# Altium project Relay PCB.PrjPcb
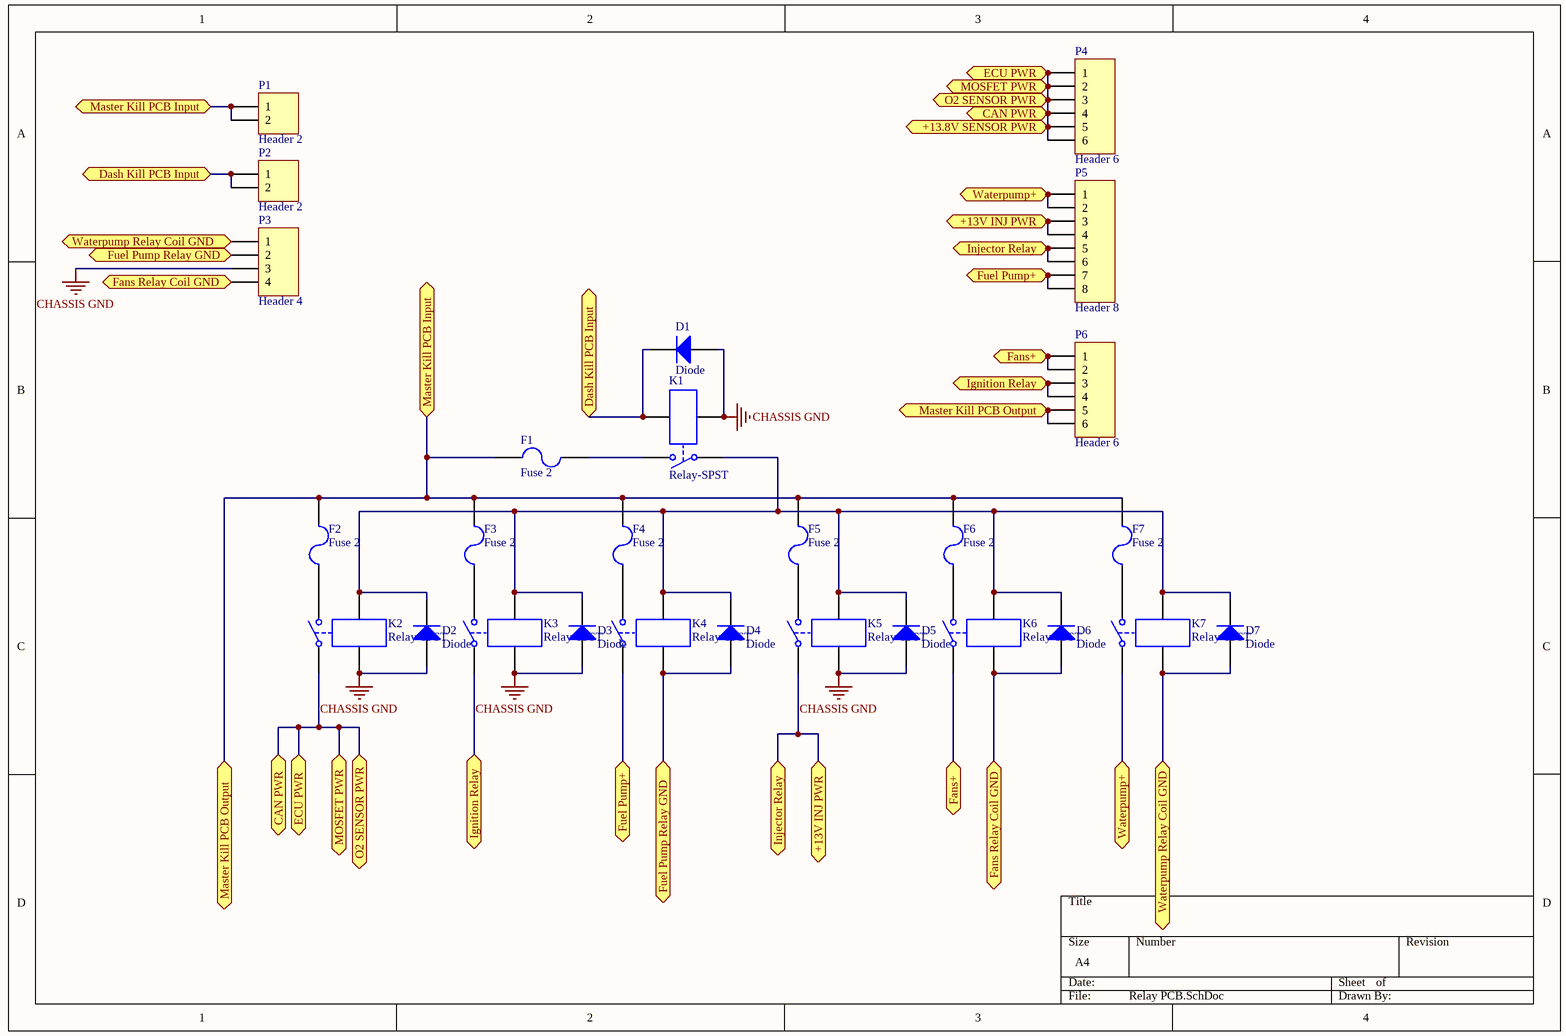
[diagram p0: Relay PCB.SchDoc]
2 sheets, 37 parts. Net scope: flat (ports and power ports of the same name join across sheets).
Board file: Relay PCB.PcbDoc
Sheets:
  Relay PCB.SchDoc
  EnclosurePinout.SchDoc

## Sheet Relay PCB.SchDoc
size A4

### Parts
D1  Diode  [SMC]
D2  Diode  [SMC]
D3  Diode  [SMC]
D4  Diode  [SMC]
D5  Diode  [SMC]
D6  Diode  [SMC]
D7  Diode  [SMC]
F1  Fuse 2  [PIN-W2/E2.8]
F2  Fuse 2  [PIN-W2/E2.8]
F3  Fuse 2  [PIN-W2/E2.8]
F4  Fuse 2  [PIN-W2/E2.8]
F5  Fuse 2  [PIN-W2/E2.8]
F6  Fuse 2  [PIN-W2/E2.8]
F7  Fuse 2  [PIN-W2/E2.8]
K1  Relay-SPST  [MODULE4]
K2  Relay-SPST  [MODULE4]
K3  Relay-SPST  [MODULE4]
K4  Relay-SPST  [MODULE4]
K5  Relay-SPST  [MODULE4]
K6  Relay-SPST  [MODULE4]
K7  Relay-SPST  [MODULE4]
P1  Header 2  [HDR1X2]
P2  Header 2  [HDR1X2]
P3  Header 4  [HDR1X4]
P4  Header 6  [HDR1X6]
P5  Header 8  [HDR1X8]
P6  Header 6  [HDR1X6]

### Ports
+13.8V SENSOR PWR, +13V INJ PWR, CAN PWR, Dash Kill PCB Input, ECU PWR, Fans Relay Coil GND, Fans+, Fuel Pump Relay GND, Fuel Pump+, Ignition Relay, Injector Relay, Master Kill PCB Input, Master Kill PCB Output, MOSFET PWR, O2 SENSOR PWR, Waterpump Relay Coil GND, Waterpump+

### Nets
CHASSIS GND: D1.1(A) D2.1(A) D3.1(A) D5.1(A) K1.3 K2.3 K3.3 K5.3 P3.3
NetActuator_1: K3.1 P6.3 P6.4 ; port Ignition Relay
NetActuator_2: K5.1 P5.3 P5.4 P5.5 P5.6 ; port Injector Relay, port +13V INJ PWR
NetCAN_1: K2.1 P4.1 P4.2 P4.3 P4.4 P4.5 P4.6 ; port ECU PWR, port MOSFET PWR, port O2 SENSOR PWR, port CAN PWR, port +13.8V SENSOR PWR
NetD1_2: D1.2(K) K1.4 P2.1 P2.2 ; port Dash Kill PCB Input
NetD2_2: D2.2(K) D3.2(K) D4.2(K) D5.2(K) D6.2(K) D7.2(K) K1.1 K2.4 K3.4 K4.4 K5.4 K6.4 K7.4
NetD4_1: D4.1(A) K4.3 P3.2 ; port Fuel Pump Relay GND
NetD6_1: D6.1(A) K6.3 P3.4 ; port Fans Relay Coil GND
NetD7_1: D7.1(A) K7.3 P3.1 ; port Waterpump Relay Coil GND
NetDash_1: F1.1 F2.2 F3.2 F4.2 F5.2 F6.2 F7.2 P1.1 P1.2 P6.5 P6.6 ; port Master Kill PCB Input, port Master Kill PCB Output
NetF1_2: F1.2 K1.2
NetF2_1: F2.1 K2.2
NetF3_1: F3.1 K3.2
NetF4_1: F4.1 K4.2
NetF5_1: F5.1 K5.2
NetF6_1: F6.1 K6.2
NetF7_1: F7.1 K7.2
NetK4_1: K4.1 P5.7 P5.8 ; port Fuel Pump+
NetK6_1: K6.1 P6.1 P6.2 ; port Fans+
NetK7_1: K7.1 P5.1 P5.2 ; port Waterpump+

### Library data of the parts
D1-D7 = Diode: Default Diode; Published: 8-Jun-2000; LatestRevisionDate: 17-Jul-2002; LatestRevisionNote: Re-released for DXP Platform.; PackageVersion: Sep-1996; PackageReference: SMC; Publisher: Altium Limited; PackageDescription: DO-214-AB/SMC; 2 C-Bend Leads; Body 7.9 x 5.9 mm, inc. leads (LxW); Code_JEDEC: DO-214-AB
F1-F7 = Fuse 2: Fuse; Published: 8-Jun-2000; LatestRevisionDate: 17-Jul-2002; LatestRevisionNote: Re-released for DXP Platform.; PackageReference: PIN-W2/E2.8; Publisher: Altium Limited; PackageDescription: Thru-Hole; 2 Leads
K1-K7 = Relay-SPST: Single-Pole Single-Throw Relay; Published: 24-Mar-1999; LatestRevisionDate: 17-Jul-2002; LatestRevisionNote: Re-released for DXP Platform.; PackageReference: MODULE4; Publisher: Altium Limited
P1 P2 = Header 2: Header, 2-Pin; LatestRevisionDate: 17-Jul-2002; LatestRevisionNote: Re-released for DXP Platform.; Publisher: Altium Limited
P3 = Header 4: Header, 4-Pin; LatestRevisionDate: 17-Jul-2002; LatestRevisionNote: Re-released for DXP Platform.; Publisher: Altium Limited
P4 P6 = Header 6: Header, 6-Pin; LatestRevisionDate: 17-Jul-2002; LatestRevisionNote: Re-released for DXP Platform.; Publisher: Altium Limited
P5 = Header 8: Header, 8-Pin; LatestRevisionDate: 17-Jul-2002; LatestRevisionNote: Re-released for DXP Platform.; Publisher: Altium Limited

## Sheet EnclosurePinout.SchDoc
size A3
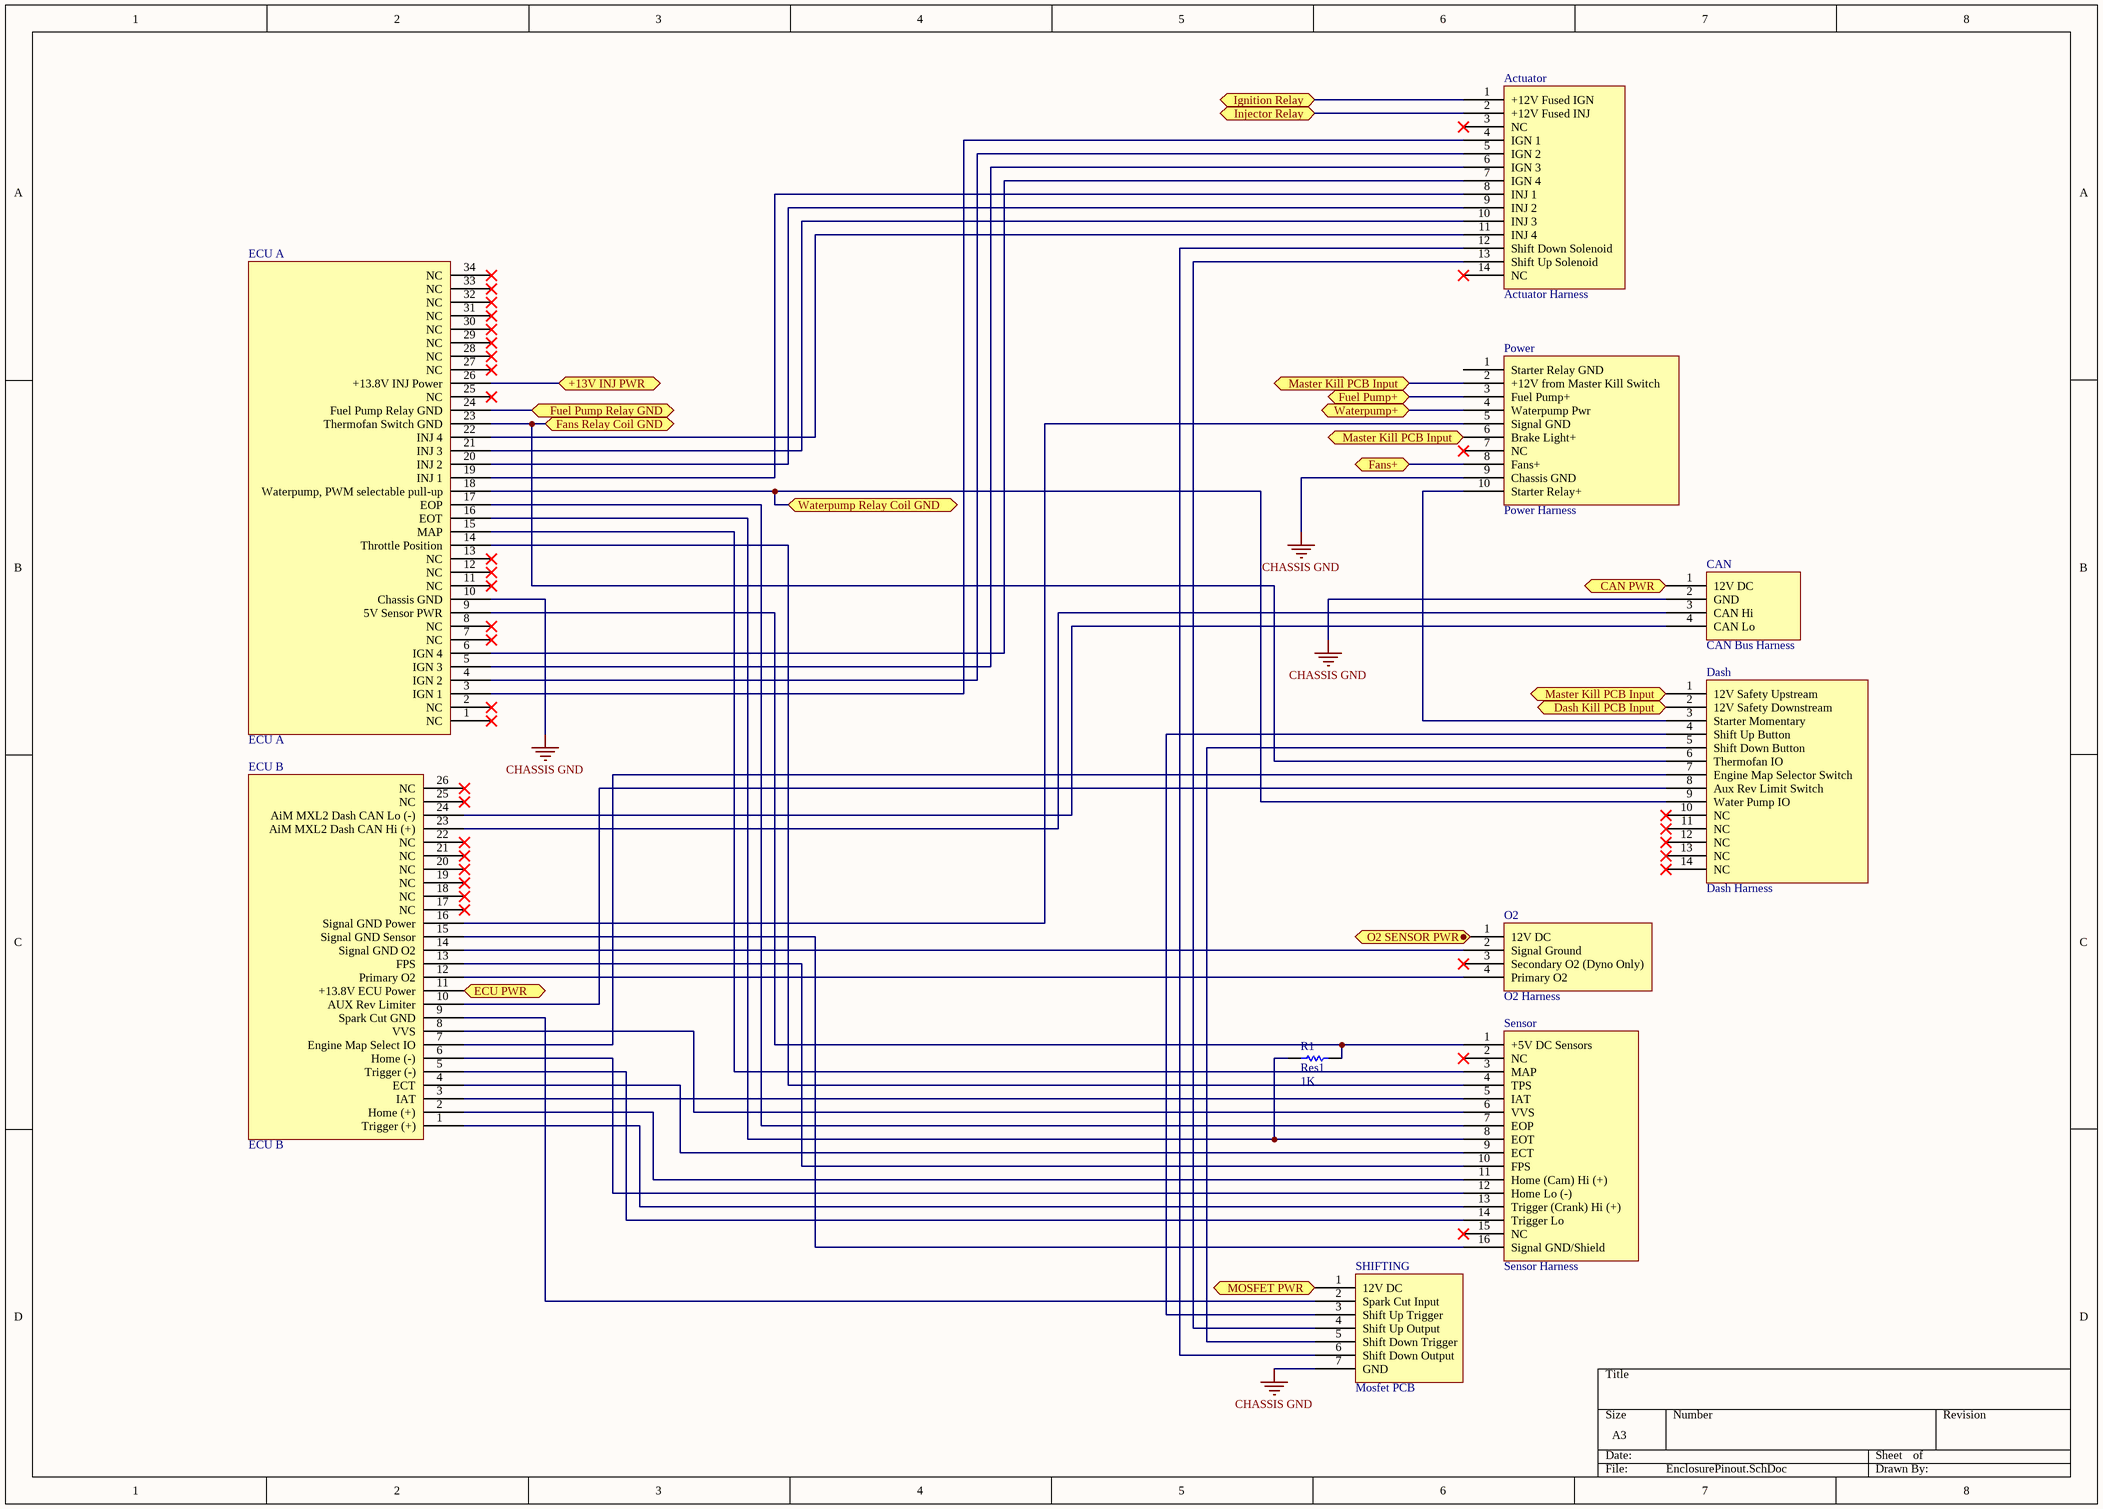
[diagram p1: EnclosurePinout.SchDoc]

### Parts
Actuator  Actuator Harness
CAN  CAN Bus Harness
Dash  Dash Harness
ECU_A  ECU A
ECU_B  ECU B
O2  O2 Harness
Power  Power Harness
R1  Res1  value 1K  [AXIAL-0.3]
Sensor  Sensor Harness
SHIFTING  Mosfet PCB

### Ports
+13V INJ PWR, CAN PWR, Dash Kill PCB Input, ECU PWR, Fans Relay Coil GND, Fans+, Fuel Pump Relay GND, Fuel Pump+, Ignition Relay, Injector Relay, Master Kill PCB Input, MOSFET PWR, O2 SENSOR PWR, Waterpump Relay Coil GND, Waterpump+

### Nets
CHASSIS GND: CAN.2(GND) ECU_A.10(Chassis_GND) Power.9(Chassis_GND) SHIFTING.7(GND)
NetActuator_1: Actuator.1(+12V_Fused_IGN) ; port Ignition Relay
NetActuator_2: Actuator.2(+12V_Fused_INJ) ECU_A.26(+13.8V_INJ_Power) ; port +13V INJ PWR, port Injector Relay
NetActuator_4: Actuator.4(IGN_1) ECU_A.3(IGN_1)
NetActuator_5: Actuator.5(IGN_2) ECU_A.4(IGN_2)
NetActuator_6: Actuator.6(IGN_3) ECU_A.5(IGN_3)
NetActuator_7: Actuator.7(IGN_4) ECU_A.6(IGN_4)
NetActuator_8: Actuator.8(INJ_1) ECU_A.19(INJ_1)
NetActuator_9: Actuator.9(INJ_2) ECU_A.20(INJ_2)
NetActuator_10: Actuator.10(INJ_3) ECU_A.21(INJ_3)
NetActuator_11: Actuator.11(INJ_4) ECU_A.22(INJ_4)
NetActuator_12: Actuator.12(Shift_Down_Solenoid) SHIFTING.6(Shift_Down_Output)
NetActuator_13: Actuator.13(Shift_Up_Solenoid) SHIFTING.4(Shift_Up_Output)
NetCAN_1: CAN.1(12V_DC) ECU_B.11(+13.8V_ECU_Power) SHIFTING.1(12V_DC) ; port ECU PWR, port CAN PWR, port MOSFET PWR, port O2 SENSOR PWR
NetCAN_3: CAN.3(CAN_Hi) ECU_B.23(AiM_MXL2_Dash_CAN_Hi_(+))
NetCAN_4: CAN.4(CAN_Lo) ECU_B.24(AiM_MXL2_Dash_CAN_Lo_(-))
NetD1_2: Dash.2(12V_Safety_Downstream) ; port Dash Kill PCB Input
NetD4_1: ECU_A.24(Fuel_Pump_Relay_GND) ; port Fuel Pump Relay GND
NetD6_1: Dash.6(Thermofan_IO) ECU_A.23(Thermofan_Switch_GND) ; port Fans Relay Coil GND
NetD7_1: Dash.9(Water_Pump_IO) ECU_A.18(Waterpump,_PWM_selectable_pull-up) ; port Waterpump Relay Coil GND
NetDash_1: Dash.1(12V_Safety_Upstream) Power.2(+12V_from_Master_Kill_Switch) Power.6(Brake_Light+) ; port Master Kill PCB Input
NetDash_3: Dash.3(Starter_Momentary) Power.10(Starter_Relay+)
NetDash_4: Dash.4(Shift_Up_Button) SHIFTING.3(Shift_Up_Trigger)
NetDash_5: Dash.5(Shift_Down_Button) SHIFTING.5(Shift_Down_Trigger)
NetDash_7: Dash.7(Engine_Map_Selector_Switch) ECU_B.7(Engine_Map_Select_IO)
NetDash_8: Dash.8(Aux_Rev_Limit_Switch) ECU_B.10(AUX_Rev_Limiter)
NetECU_A_9: ECU_A.9(5V_Sensor_PWR) R1.1 Sensor.1(+5V_DC_Sensors)
NetECU_A_14: ECU_A.14(Throttle_Position) Sensor.4(TPS)
NetECU_A_15: ECU_A.15(MAP) Sensor.3(MAP)
NetECU_A_16: ECU_A.16(EOT) R1.2 Sensor.8(EOT)
NetECU_A_17: ECU_A.17(EOP) Sensor.7(EOP)
NetECU_B_1: ECU_B.1(Trigger_(+)) Sensor.13(Trigger_(Crank)_Hi_(+))
NetECU_B_2: ECU_B.2(Home_(+)) Sensor.11(Home_(Cam)_Hi_(+))
NetECU_B_3: ECU_B.3(IAT) Sensor.5(IAT)
NetECU_B_4: ECU_B.4(ECT) Sensor.9(ECT)
NetECU_B_5: ECU_B.5(Trigger_(-)) Sensor.14(Trigger_Lo)
NetECU_B_6: ECU_B.6(Home_(-)) Sensor.12(Home_Lo_(-))
NetECU_B_8: ECU_B.8(VVS) Sensor.6(VVS)
NetECU_B_9: ECU_B.9(Spark_Cut_GND) SHIFTING.2(Spark_Cut_Input)
NetECU_B_12: ECU_B.12(Primary_O2) O2.4(Primary_O2)
NetECU_B_13: ECU_B.13(FPS) Sensor.10(FPS)
NetECU_B_14: ECU_B.14(Signal_GND_O2) O2.2(Signal_Ground)
NetECU_B_15: ECU_B.15(Signal_GND_Sensor) Sensor.16(Signal_GND/Shield)
NetECU_B_16: ECU_B.16(Signal_GND_Power) Power.5(Signal_GND)
NetK4_1: Power.3(Fuel_Pump+) ; port Fuel Pump+
NetK6_1: Power.8(Fans+) ; port Fans+
NetK7_1: Power.4(Waterpump_Pwr) ; port Waterpump+

Not connected (* = marked no-connect by the designer): Actuator 3(NC)* 14(NC)*; Dash 10(NC)* 11(NC)* 12(NC)* 13(NC)* 14(NC)*; ECU_A 1(NC)* 2(NC)* 7(NC)* 8(NC)* 11(NC)* 12(NC)* 13(NC)* 25(NC)* 27(NC)* 28(NC)* 29(NC)* 30(NC)* 31(NC)* 32(NC)* 33(NC)* 34(NC)*; ECU_B 17(NC)* 18(NC)* 19(NC)* 20(NC)* 21(NC)* 22(NC)* 25(NC)* 26(NC)*; O2 1(12V_DC) 3(Secondary_O2_(Dyno_Only))*; Power 1(Starter_Relay_GND) 7(NC)*; Sensor 2(NC)* 15(NC)*

### Library data of the parts
R1 = Res1: Resistor; Published: 8-Jun-2000; LatestRevisionDate: 17-Jul-2002; LatestRevisionNote: Re-released for DXP Platform.; PackageReference: AXIAL-0.3; Publisher: Altium Limited; PackageDescription: Axial Device, Thru-Hole; 2 Leads; 0.3 in Pin Spacing

## Nets that join several sheets
CHASSIS GND: Relay PCB (9 pins), EnclosurePinout (CAN.2 ECU_A.10 Power.9 SHIFTING.7)
NetActuator_1: Relay PCB (K3.1 P6.3 P6.4), EnclosurePinout (Actuator.1)
NetActuator_2: Relay PCB (5 pins), EnclosurePinout (Actuator.2 ECU_A.26)
NetCAN_1: Relay PCB (7 pins), EnclosurePinout (CAN.1 ECU_B.11 SHIFTING.1)
NetD1_2: Relay PCB (D1.2 K1.4 P2.1 P2.2), EnclosurePinout (Dash.2)
NetD4_1: Relay PCB (D4.1 K4.3 P3.2), EnclosurePinout (ECU_A.24)
NetD6_1: Relay PCB (D6.1 K6.3 P3.4), EnclosurePinout (Dash.6 ECU_A.23)
NetD7_1: Relay PCB (D7.1 K7.3 P3.1), EnclosurePinout (Dash.9 ECU_A.18)
NetDash_1: Relay PCB (11 pins), EnclosurePinout (Dash.1 Power.2 Power.6)
NetK4_1: Relay PCB (K4.1 P5.7 P5.8), EnclosurePinout (Power.3)
NetK6_1: Relay PCB (K6.1 P6.1 P6.2), EnclosurePinout (Power.8)
NetK7_1: Relay PCB (K7.1 P5.1 P5.2), EnclosurePinout (Power.4)